# EAGLE design Single_Item_Sensor (EAGLE 8.5.0)
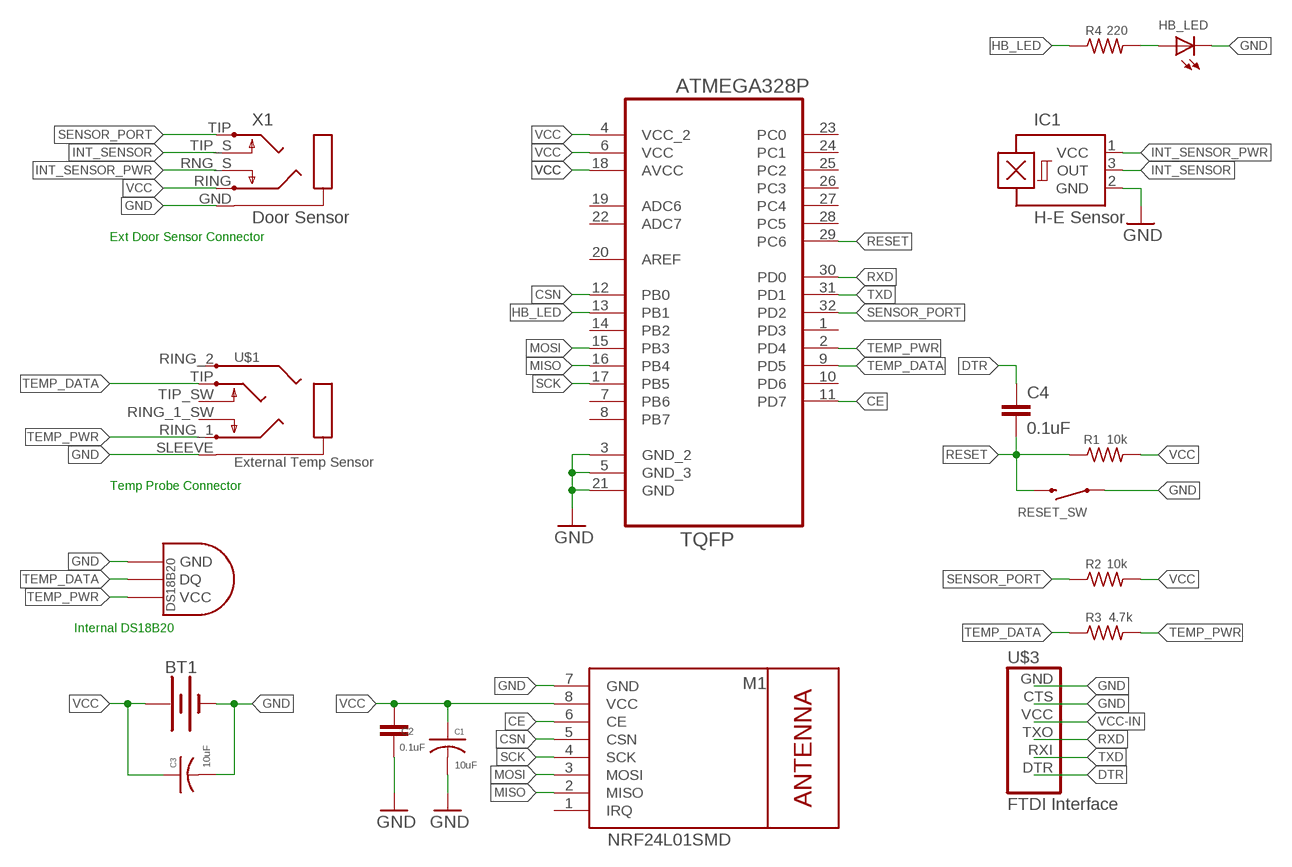
[diagram p0: schematic, sheet 1]

## Parts
BT1  BATTERY-20MM_SMD_4LEGS  [BATTCON_20MM_4LEGS]
C1  10uF  C-USC1206  [C1206]
C2  0.1uF  CAP1206  [1206]
C3  10uF  C-USC1206  [C1206]
C4  0.1uF  CAP1206  [1206]
HB_LED  LEDCHIP-LED0603  [CHIP-LED0603]
IC1  H-E Sensor  A1202UA  [SIP3-UA]
M1  NRF24L01SMD  WIRELESS-NRF24L01SMD  [WIRELESS-NRF24L01-SMD]
R1  10k  R-US_M1206  [M1206]
R2  10k  R-US_M1206  [M1206]
R3  4.7k  R-US_M1206  [M1206]
R4  220  R-US_M1206  [M1206]
RESET_SW  SWITCH-MOMENTARY-2-SMD-1101NE  [TACTILE-SWITCH-1101NE]
U1  ATMEGA328P-AU  [QFP80P900X900X120-32N]
U$1  External Temp Sensor  PJ-242  [PJ-242]
U$2  DS1820TO92  [DS1820]
U$3  FTDI Interface  FTDI-HEADER  [1X6-FTDI]
X1  Door Sensor  PG203JPJ-328  [PG203J]

## Nets
CE: M1.6(CE) U1.11(PD7)
CSN: M1.5(CSN) U1.12(PB0)
DTR: C4.1 U$3.DTR
GND: BT1.NEGATIVE(-) C1.2 C2.2 C3.2 HB_LED.C IC1.2(GND) M1.7(GND) RESET_SW.P$1 U1.3(GND_2) U1.5(GND_3) U1.21(GND) U$1.SLEEVE U$2.GND U$3.CTS U$3.GND X1.GND
HB_LED: R4.1 U1.13(PB1)
INT_SENSOR: IC1.3(OUT) X1.TIP_S
INT_SENSOR_PWR: IC1.1(VCC) X1.RNG_S
LED+: HB_LED.A R4.2
MISO: M1.2(MISO) U1.16(PB4)
MOSI: M1.3(MOSI) U1.15(PB3)
RESET: C4.2 R1.1 RESET_SW.P$2 U1.29(PC6)
RXD: U1.30(PD0) U$3.TXO
SCK: M1.4(SCK) U1.17(PB5)
SENSOR_PORT: R2.1 U1.32(PD2) X1.TIP
TEMP_DATA: R3.1 U1.9(PD5) U$1.TIP U$2.DQ
TEMP_PWR: R3.2 U1.2(PD4) U$1.RING_1 U$2.VDD(VCC)
TXD: U1.31(PD1) U$3.RXI
VCC: BT1.POSITIVE@1(+) BT1.POSITIVE@2(+) BT1.POSITIVE@3(+) BT1.POSITIVE@4(+) C1.1 C2.1 C3.1 M1.8(VCC) R1.2 R2.2 U1.4(VCC_2) U1.6(VCC) U1.18(AVCC) X1.RING
VCC-IN: U$3.VCC
Unconnected: M1.1(IRQ) U1.1(PD3) U1.7(PB6) U1.8(PB7) U1.10(PD6) U1.14(PB2) U1.19(ADC6) U1.20(AREF) U1.22(ADC7) U1.23(PC0) U1.24(PC1) U1.25(PC2) U1.26(PC3) U1.27(PC4) U1.28(PC5) U$1.RING_1_SW U$1.RING_2 U$1.TIP_SW

## Notes on the sheet
- Ext Door Sensor Connector
- Temp Probe Connector
- Internal DS18B20

## Library data of the parts
BT1 = SparkFun-Batteries:BATTERY: Battery - Single Cell A variety of battery chemistries, sizes, and footprints. Device List: 20MM_PTH - Coin Cell Battery Holder - 20mm (PTH) <https://www.sparkfun.com/products/783> 6.8MM_PTH - Coin Cell Battery Holder - 6.8MM(SMD) <https://www.digikey.com/product-detail/en/seiko-instruments/MS621FE-FL11E/728-1057-ND/1889208?WT.srch=1&gclid=CNOQ5a6LzdQCFZS2wAodXCkE0g> 12MM_SMD - Coin Cell Battery Holder - 12mm (SMD) <https://www.sparkfun.com/products/10592> 12MM_PTH - Coin Cell Battery Holder - 12mm (PTH) <https://www.sparkfun.com/products/7948> 20MM_SMD - 20mm Coin Cell Battery Holder (SMD) (2 legs) Used on the Big Time Watch Kit <https://www.sparkfun.com/products/11734> 20MM_SMD_4LEGS - Coin Cell Battery Holder - 20mm (SMD) <https://www.sparkfun.com/products/11892> 20MM_SMD_4LEGS_OVERPASTE - Coin Cell Battery Holder - 20mm (SMD) <https://www.sparkfun.com/products/11892> (Over-paste on the legs) 24.5MM_PTH - Coin Cell Battery Holder - 24.5mm (PTH) <https://www.sparkfun.com/products/8863> 9V - 9V Battery Holder - PC Mount Used on the SparkFun SparkPunk Sound Kit <https://www.sparkfun.com/products/11177> and SparkFun SparkPunk Sequencer Kit <https://www.sparkfun.com/products/12707> 18650 - Battery Holder - 18650 (PTH) <https://www.sparkfun.com/products/13113> AA - Battery Holder - 1xAA (PTH) <https://www.sparkfun.com/products/7949> AAA - Battery Holder - 1xAAA (PTH) <https://www.sparkfun.com/products/12718> AA_KIT - Battery Holder - 1xAA (PTH) <https://www.sparkfun.com/products/7949> Special kit package - pads only have exposed copper on one side of the board. AAA_KIT - Battery Holder - 1xAAA (PTH) <https://www.sparkfun.com/products/12718> Special kit package - pads only have exposed copper on one side of the board.; PROD_ID: BATT-10373; SF_SKU: PRT-11892
C1 C3 = adafruit:C-US: CAPACITOR, American symbol
C2 C4 = GDOv5 Board:CAP: Capacitor Standard 0603 ceramic capacitor, and 0.1" leaded capacitor.
HB_LED = GDOv5 Board:LED: LED OSRAM: - CHIPLED LG R971, LG N971, LY N971, LG Q971, LY Q971, LO R971, LY R971 LH N974, LH R974 LS Q976, LO Q976, LY Q976 LO Q996 - Hyper CHIPLED LW Q18S LB Q993, LB Q99A, LB R99A - SideLED LS A670, LO A670, LY A670, LG A670, LP A670 LB A673, LV A673, LT A673, LW A673 LH A674 LY A675 LS A676, LA A676, LO A676, LY A676, LW A676 LS A679, LY A679, LG A679 - Hyper Micro SIDELED® LS Y876, LA Y876, LO Y876, LY Y876 LT Y87S - SmartLED LW L88C, LW L88S LB L89C, LB L89S, LG L890 LS L89K, LO L89K, LY L89K LS L896, LA L896, LO L896, LY L896 - TOPLED LS T670, LO T670, LY T670, LG T670, LP T670 LSG T670, LSP T670, LSY T670, LOP T670, LYG T670 LG T671, LOG T671, LSG T671 LB T673, LV T673, LT T673, LW T673 LH T674 LS T676, LA T676, LO T676, LY T676, LB T676, LH T676, LSB T676, LW T676 LB T67C, LV T67C, LT T67C, LS T67K, LO T67K, LY T67K, LW E67C LS E67B, LA E67B, LO E67B, LY E67B, LB E67C, LV E67C, LT E67C LW T67C LS T679, LY T679, LG T679 LS T770, LO T770, LY T770, LG T770, LP T770 LB T773, LV T773, LT T773, LW T773 LH T774 LS E675, LA E675, LY E675, LS T675 LS T776, LA T776, LO T776, LY T776, LB T776 LHGB T686 LT T68C, LB T68C - Hyper Mini TOPLED® LB M676 - Mini TOPLED Santana® LG M470 LS M47K, LO M47K, LY M47K Source: http://www.osram.convergy.de/
IC1 = allegro:A12*?: Hall-effect bipolar switch Source: http://www.allegromicro.com/en/Products/Part_Numbers/1202/1202.pdf; OC_FARNELL: unknown; OC_NEWARK: unknown
M1 = nrf24l01plus:WIRELESS-NRF24L01: 2.4 GHz Wireless Module based on NRF24L01 chip
R1-R4 = adafruit:R-US_: RESISTOR, American symbol
RESET_SW = GDOv5 Board:SWITCH-MOMENTARY-2: Various NO switches- pushbuttons, reed, etc
U1 = Ava:ATMEGA328P-AU; DESCRIPTION: 8-bit Microcontroller with In-System Programmable Flash; MPN: ATMEGA328P-AU; OC_FARNELL: 1715486; OC_NEWARK: 14R4631; PACKAGE: TQFP-32; SUPPLIER: Atmel
U$1 = GDOv5 Board:PJ-242: 2.5mm TRRS minijack with switches on T1/R1
U$2 = Ava:DS1820: DS18B20 Programmable Resolution 1-Wire Digital Thermometer Description The DS18B20 digital thermometer provides 9-bit to 12-bit Celsius temperature measurements and has an alarm function with nonvolatile user-programmable upper and lower trigger points. The DS18B20 communicates over a 1-Wire® bus that by definition requires only one data line (and ground) for communication with a central microprocessor. It has an operating temperature range of -55°C to +125°C and is accurate to ±0.5°C over the range of -10°C to +85°C. In addition, the DS18B20 can derive power directly from the data line ("parasite power"), eliminating the need for an external power supply. Each DS18B20 has a unique 64-bit serial code, which allows multiple DS18B20s to function on the same 1-Wire bus. Thus, it is simple to use one microprocessor to control many DS18B20s distributed over a large area. Applications that can benefit from this feature include HVAC environmental controls, temperature monitoring systems inside buildings, equipment, or machinery, and process monitoring and control systems.
U$3 = GDOv5 Board:FTDI-HEADER
X1 = GDOv5 Board:PG203J: 3.5mm Mic/Headphone Jack Stereo microphone/headphone jack PJ-328

## Board
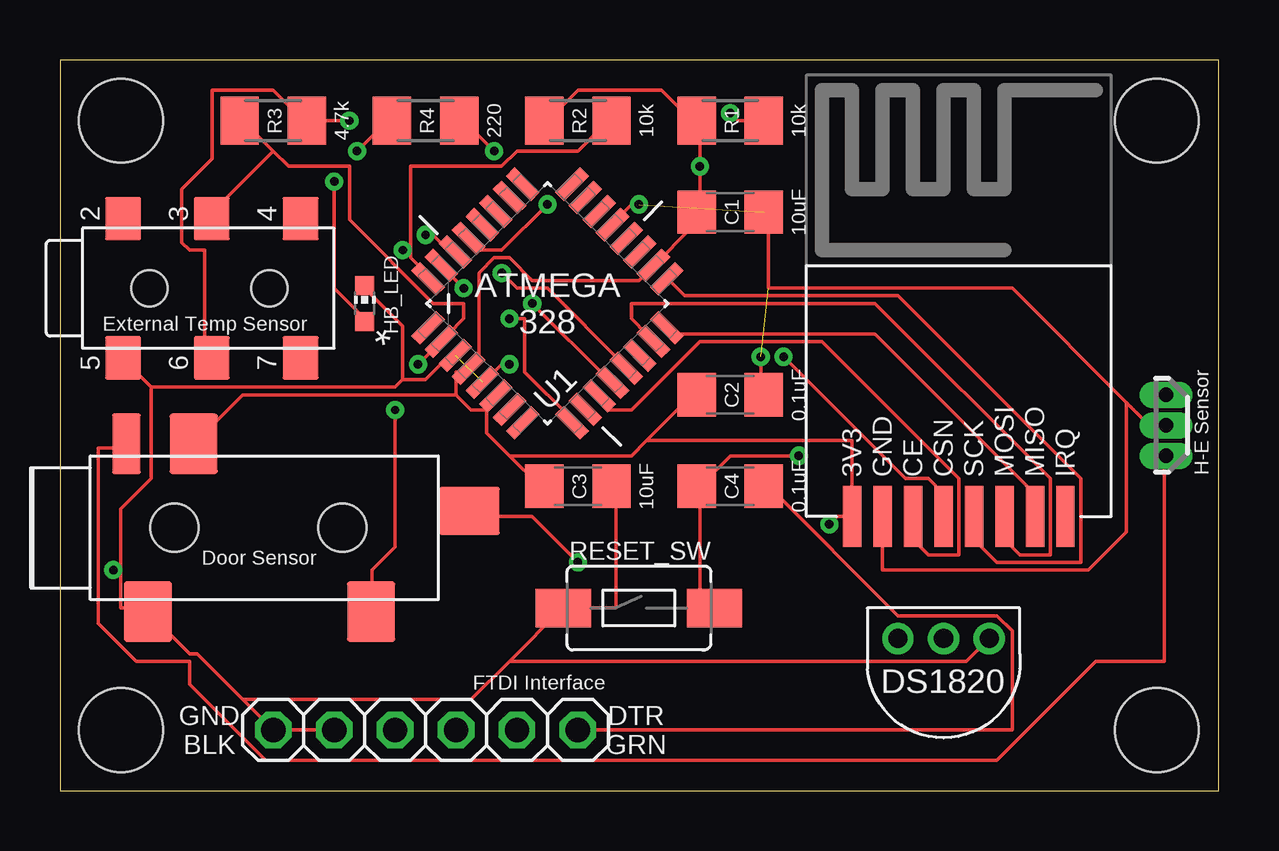
[diagram p1: board, top side]
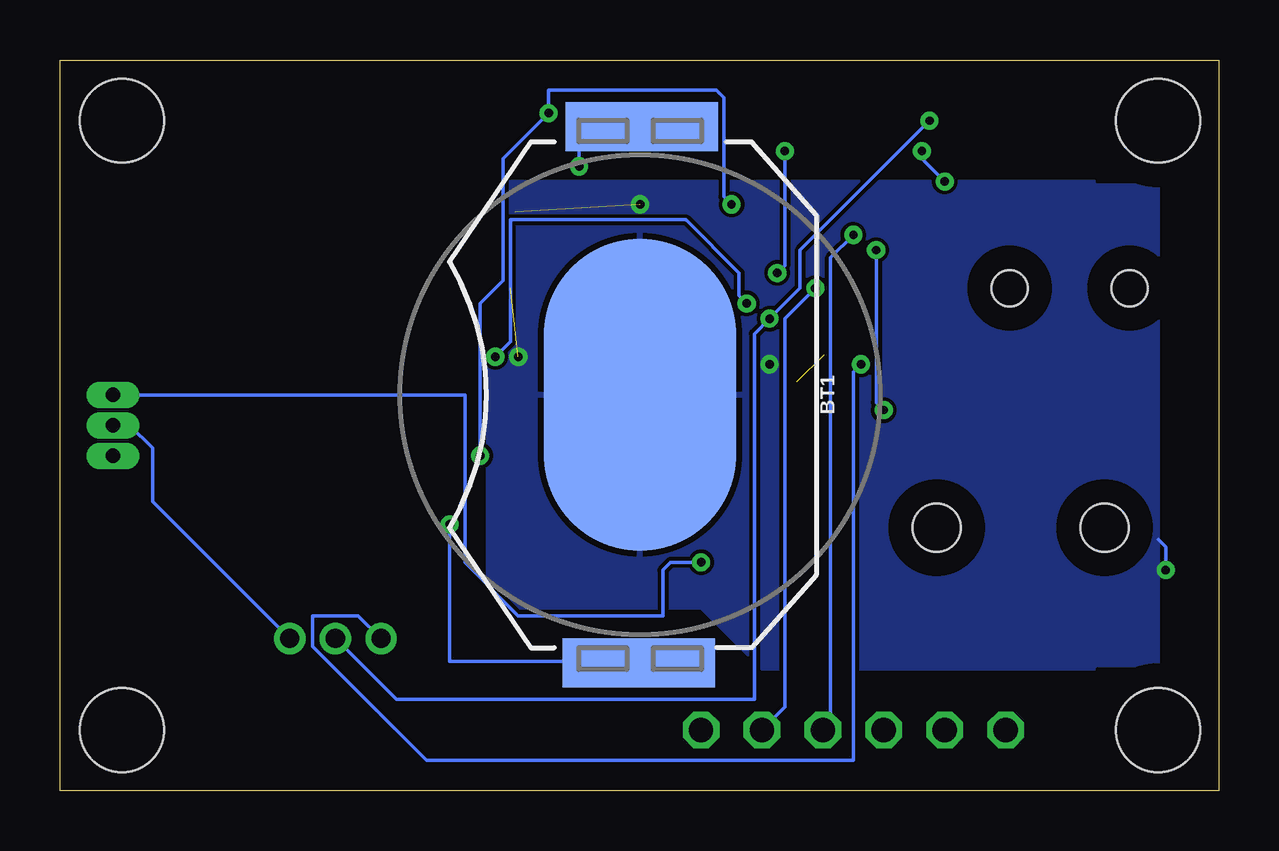
[diagram p2: board, bottom side, seen from below]

Size 48.31 x 30.47 mm. Coordinates in mm from the lower left corner, seen from the top.
Outline: 0,0 48.31,0 48.31,30.47 0,30.47 0,0
Copper layers (1*16): Top 0.035mm / dielectric 1.5mm / Bottom 0.035mm
Design rules "default": minimum track width 6mil, minimum drill 0.35mm, track to track 6mil, track to pad 6mil, pad to pad 6mil, via to via 6mil, smd to smd 6mil, copper to edge 40mil, drill to drill 6mil, minimum pad ring 10mil, minimum via ring 8mil, stop-mask expansion 4mil, vias tented up to drill 0mil, thermal gap 10mil
Holes 3.5 mm at 2.54,27.94 45.72,27.94 2.54,2.54 45.72,2.54
tKeepout: area 31.1,21.8 to 31.2,29.7
tRestrict: area 43.2,0 to 48.3,5.1; area 0,0 to 5.1,5.1; area 0,25.4 to 5.1,30.5; area 30.5,21.6 to 48.3,30.5
bRestrict: area 30.5,21.6 to 48.3,30.5; area 43.2,0 to 48.3,5.1; area 0,0 to 5.1,5.1; area 0,25.4 to 5.1,30.5

### Footprints (pad centres in the part's own frame; a part is rotated, then mirrored left to right if it is on the bottom)
BATTCON_20MM_4LEGS = smd 13 x 8: NEGATIVE 0,0 | smd 2.032 x 3.175: POSITIVE@1 -11.176,1.651; POSITIVE@2 -11.176,-1.524; POSITIVE@3 11.176,1.524; POSITIVE@4 11.176,-1.651
C1206 = smd 1.6 x 1.8: 1 -1.4,0; 2 1.4,0
1206 = smd 1.6 x 1.8: 1 -1.4,0; 2 1.4,0
CHIP-LED0603 = smd 0.8 x 0.8: A 0,-0.75; C 0,0.75
SIP3-UA = drill 0.6 pad 0.7 long: 1 -1.27,0; 2 0,0; 3 1.27,0
WIRELESS-NRF24L01-SMD = smd 2.54 x 0.762: 1 1.27,0; 2 1.27,1.27; 3 1.27,2.54; 4 1.27,3.81; 5 1.27,5.08; 6 1.27,6.35; 7 1.27,7.62; 8 1.27,8.89
M1206 = smd 1.6 x 2: 1 -1.4,0; 2 1.4,0
TACTILE-SWITCH-1101NE = smd 2.3 x 1.6: P$1 -3.15,0; P$2 3.15,0
QFP80P900X900X120-32N = smd 1.473 x 0.508: 1 -4.242,2.794; 2 -4.242,2.007; 3 -4.242,1.194; 4 -4.242,0.406; 5 -4.242,-0.406; 6 -4.242,-1.194; 7 -4.242,-2.007; 8 -4.242,-2.794; 17 4.242,-2.794; 18 4.242,-2.007; 19 4.242,-1.194; 20 4.242,-0.406; 21 4.242,0.406; 22 4.242,1.194; 23 4.242,2.007; 24 4.242,2.794 | smd 0.508 x 1.473: 9 -2.794,-4.242; 10 -2.007,-4.242; 11 -1.194,-4.242; 12 -0.406,-4.242; 13 0.406,-4.242; 14 1.194,-4.242; 15 2.007,-4.242; 16 2.794,-4.242; 25 2.794,4.242; 26 2.007,4.242; 27 1.194,4.242; 28 0.406,4.242; 29 -0.406,4.242; 30 -1.194,4.242; 31 -2.007,4.242; 32 -2.794,4.242
PJ-242 = smd 1.5 x 1.8: RING_1 -5.1,2.9; RING_1_SW -1.4,2.9; RING_2 -8.8,2.9; SLEEVE -8.8,-2.9; TIP -5.1,-2.9; TIP_SW -1.4,-2.9 | hole 1.5: -7.7,0; -2.7,0
DS1820 = drill 0.8: DQ 2.54,-1.27; GND 0.635,-1.27; VDD 4.445,-1.27
1X6-FTDI = drill 1.016 octagon: CTS 3.81,0; DTR -6.35,0; GND 6.35,0; RXI -3.81,0; TXO -1.27,0; VCC 1.27,0
PG203J = smd 2 x 2.5: GND 2.4,-6.5; RING 4.3,0.5; TIP 11.7,-6.5 | smd 1.2 x 2.5: RNG_S 1.5,0.5 | smd 2.5 x 2: TIP_S 15.8,-2.3 | hole 2: 3.5,-3; 10.5,-3

### Placement (x,y rotation side)
BT1  24.13,16.51 270 bottom
C1  27.94,24.13 0 top
C2  27.94,16.51 0 top
C3  21.59,12.7 0 top
C4  27.94,12.7 180 top
HB_LED  12.7,20.32 0 top
IC1  46.1,15.24 90 top
M1  41.91,10.16 90 top
R1  27.94,27.94 180 top
R2  21.59,27.94 180 top
R3  8.89,27.94 180 top
R4  15.24,27.94 180 top
RESET_SW  24.13,7.62 0 top
U1  20.32,20.32 45 top
U$1  11.43,20.95 0 top
U$2  39.37,5.08 180 top
U$3  15.24,2.54 180 top
X1  1.27,13.97 0 top

### Tracks (layer width: path | path; a pad name or v marks a point on that pad's centre or on a via)
CE
  Top 0.152: M1.6 35.56,10.48 36.2,9.84 37.47,9.84 37.47,13.02 31.75,18.73 26.67,18.73 23.81,15.88 22.86,15.88 22.54,16.19 U1.11
CSN  (via drill 0.35)
  Top 0.152: v19.68,20.32 22.86,17.15 U1.12 | v30.16,18.1 35.24,13.02 36.2,13.02 36.83,12.38 M1.5
  Bottom 0.152: v19.68,20.32 20,20.64 20,21.59 22.23,23.81 29.53,23.81 29.53,18.73 v30.16,18.1
DTR
  Top 0.152: U$3.DTR 39.69,2.54 39.69,6.67 39.05,7.3 34.92,7.3 29.53,12.7 C4.1
GND  (via drill 0.35)  (3 unrouted)
  Top 0.152: 44.45,16.19 45.4,15.24 IC1.2 | 44.45,16.19 39.69,20.95 29.53,20.95 29.53,24.13 C1.2 | M1.7 34.29,9.21 42.86,9.21 44.45,10.79 44.45,16.19 | v18.73,17.78 18.41,17.78 17.78,17.15 U1.5 | v24.13,24.45 23.81,24.45 23.18,23.81 U1.21 | v29.21,18.1 29.21,16.51 C2.2 | 14.29,17.15 14.29,19.37 12.7,20.95 HB_LED.C | 14.29,17.15 15.24,17.15 16.19,18.1 U1.3 | 3.81,16.83 2.86,17.78 U$1.SLEEVE | 3.81,16.83 13.97,16.83 14.29,17.15 | C3.2 23.18,12.7 23.18,7.62 RESET_SW.P$1 20.95,7.62 18.73,5.4 | 7.62,3.81 U$3.GND U$3.CTS | 7.62,3.81 5.71,5.71 5.4,5.71 3.81,7.3 X1.GND 3.49,7.62 2.54,7.62 2.54,9.21 | 18.73,5.4 17.14,3.81 7.62,3.81 | 3.81,16.83 3.81,13.02 2.54,11.75 2.54,9.21 | 2.54,9.21 v2.22,9.21 | U$2.GND 37.78,5.4 18.73,5.4
  Bottom 0.152: U$2.GND 44.45,12.06 44.45,14.29 45.4,15.24 IC1.2 | 2.54,10.48 2.22,10.16 v2.22,9.21
  pour Bottom: 30.48,25.4 2.54,25.4 2.54,5.08 19.05,5.08 21.59,7.62 29.21,7.62 30.48,8.89
HB_LED  (via drill 0.35)
  Top 0.152: v18.41,21.59 19.05,20.95 20.32,20.95 23.5,17.78 U1.13 | v18.1,26.67 16.83,27.94 R4.1
  Bottom 0.152: v18.41,21.59 18.1,21.91 v18.1,26.67
INT_SENSOR  (via drill 0.35)
  Top 0.152: v21.59,9.53 19.68,11.43 17.14,11.43 X1.TIP_S
  Bottom 0.152: IC1.3 31.43,16.51 31.43,9.53 29.21,7.3 23.18,7.3 23.18,9.21 22.86,9.53 v21.59,9.53
INT_SENSOR_PWR
  Top 0.152: IC1.1 46.04,13.97 46.04,5.4 43.18,5.4 39.05,1.27 8.57,1.27 5.4,4.45 5.4,5.4 3.17,5.4 1.59,6.99 1.59,14.29 2.54,14.29 X1.RNG_S
LED+  (via drill 0.35)
  Top 0.152: v11.43,25.4 11.43,20.95 12.7,19.69 HB_LED.A | v12.38,26.67 13.65,27.94 R4.2
  Bottom 0.152: v11.43,25.4 12.38,26.35 v12.38,26.67
MISO
  Top 0.152: M1.2 40.64,12.38 33.97,19.05 25.4,19.05 U1.16
MOSI
  Top 0.152: M1.3 39.37,10.48 40.01,9.84 41.27,9.84 41.27,13.02 33.97,20.32 23.81,20.32 23.81,19.69 24.45,19.05 U1.15
RESET  (via drill 0.35)
  Top 0.152: 26.67,12.7 26.67,7.62 RESET_SW.P$2 | v20.32,24.45 18.41,22.54 17.46,22.54 17.14,22.86 U1.29 | v27.94,28.26 28.26,27.94 R1.1 | 26.67,12.7 27.94,13.97 v30.8,13.97 | 26.67,12.7 C4.2
  Bottom 0.152: v20.32,24.45 20.64,24.77 20.64,28.89 20.95,29.21 27.94,29.21 v27.94,28.26 29.84,26.35 29.84,21.27 30.8,20.32 v30.8,13.97
RXD  (via drill 0.35)
  Top 0.152: v15.24,23.18 15.56,23.18 16.19,22.54 U1.30
  Bottom 0.152: v15.24,23.18 16.19,22.23 16.19,2.86 U$3.TXO
SCK
  Top 0.152: M1.4 38.1,10.48 39.05,9.53 42.55,9.53 42.55,13.02 34.92,20.64 26.04,20.64 25.4,21.27 U1.17
SENSOR_PORT  (via drill 0.35)
  Top 0.152: 14.61,22.54 14.61,26.03 18.41,26.03 19.05,26.67 21.59,26.67 22.86,27.94 R2.1 | 14.61,22.54 14.61,22.23 15.24,21.59 U1.32 | v13.97,15.88 13.97,10.16 13.02,9.21 13.02,7.62 X1.TIP | 14.61,22.54 v14.29,22.54
  Bottom 0.152: v13.97,15.88 14.29,16.19 v14.29,22.54
TEMP_DATA  (via drill 0.35)
  Top 0.152: v18.73,19.69 19.37,19.69 19.37,17.46 21.27,15.56 U1.9 | v12.06,27.94 R3.1 10.16,27.94 8.89,29.21 6.35,29.21 6.35,26.35 5.08,25.08 5.08,22.86 5.4,22.54 6.03,22.54 6.03,18.1 U$1.TIP
  Bottom 0.152: v12.06,27.94 17.46,22.54 17.46,20.95 v18.73,19.69 19.37,19.05 19.37,3.81 34.29,3.81 U$2.DQ
TEMP_PWR  (via drill 0.35)
  Top 0.152: 8.89,26.67 7.62,27.94 R3.2 | 8.89,26.67 9.53,26.03 12.06,26.03 12.06,23.81 15.56,20.32 16.83,20.32 16.83,19.69 16.19,19.05 U1.2 15.88,18.73 v14.92,17.78 | 8.89,26.67 6.35,24.13 U$1.RING_1
  Bottom 0.152: U$2.VDD 35.88,7.3 37.78,7.3 37.78,6.03 33.02,1.27 15.24,1.27 15.24,17.46 v14.92,17.78
TXD  (via drill 0.35)
  Top 0.152: v16.83,20.95 16.19,21.59 U1.31
  Bottom 0.152: v16.83,20.95 18.1,19.69 18.1,3.49 U$3.RXI
VCC  (via drill 0.35)
  Top 0.152: R2.2 20.32,27.94 21.59,29.21 25.08,29.21 26.35,27.94 R1.2 26.67,27.94 v26.67,26.03 26.67,24.13 C1.1 26.35,24.13 26.35,23.49 24.77,21.91 U1.18 24.45,21.59 24.13,21.27 19.68,21.27 18.73,22.23 18.1,22.23 17.46,21.59 17.46,17.78 17.14,17.78 U1.4 16.83,17.46 16.51,17.46 16.51,16.51 | 17.78,15.88 18.1,16.19 U1.6 17.78,15.88 | 17.78,15.88 17.14,15.88 16.51,16.51 | 18.73,13.97 17.78,14.92 17.78,15.88 | 18.73,13.97 20,12.7 C3.1 | 24.45,14.6 23.81,13.97 18.73,13.97 | 24.45,14.6 26.35,16.51 C2.1 | 16.51,16.51 7.62,16.51 5.71,14.6 X1.RING | 24.45,14.6 33.02,14.6 M1.8 32.38,11.43 v32.07,11.11
  Bottom 0.152: BT1.POSITIVE@1 22.54,27.94 25.4,27.94 BT1.POSITIVE@2 26.67,26.67 v26.67,26.03 | BT1.POSITIVE@3 22.86,5.4 25.72,5.4 BT1.POSITIVE@4 26.04,5.4 32.07,5.4 v32.07,11.11

### Text on the board
tPlace: ATMEGA / 328